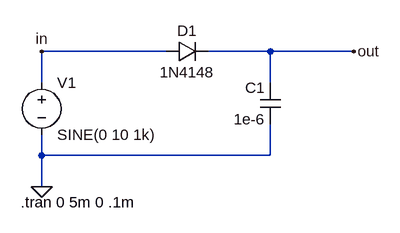
[diagram p0: schematic Sim_1_4.asc]
Sim_1_4.asc, the LTspice schematic file:
Version 4
SHEET 1 1024 680
WIRE 16 -80 -176 -80
WIRE 176 -80 80 -80
WIRE 304 -80 176 -80
WIRE -176 -32 -176 -80
WIRE 176 -32 176 -80
WIRE -176 80 -176 48
WIRE 176 80 176 32
WIRE 176 80 -176 80
WIRE -176 128 -176 80
FLAG -176 128 0
FLAG -176 -80 in
FLAG 304 -80 out
SYMBOL voltage -176 -48 R0
WINDOW 123 0 0 Left 0
WINDOW 39 0 0 Left 0
SYMATTR InstName V1
SYMATTR Value SINE(0 10 1k)
SYMBOL diode 16 -64 R270
WINDOW 0 32 32 VTop 2
WINDOW 3 0 32 VBottom 2
SYMATTR InstName D1
SYMATTR Value 1N4148
SYMBOL cap 192 32 R180
WINDOW 0 24 56 Left 2
WINDOW 3 24 8 Left 2
SYMATTR InstName C1
SYMATTR Value 1e-6
TEXT -208 152 Left 2 !.tran 0 5m 0 .1m

The netlist it stands for:
* Sim_1_4.asc
V1 in 0 SINE(0 10 1k)
D1 in out 1N4148
C1 0 out 1e-6
.model D D
.lib standard.dio
.tran 0 5m 0 .1m
.backanno
.end

* Results of the author's LTspice run, read from the files saved beside the schematic
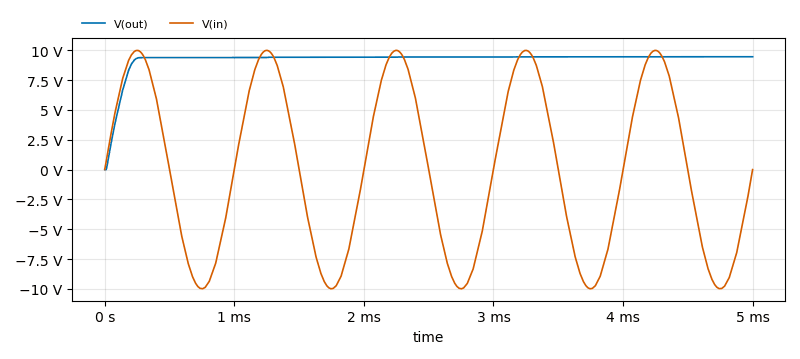
[diagram p1: Transient Analysis of Sim_1_4.asc, plotted from the saved traces]
* Transient Analysis, 1 run:
*   V(out): min 0 V, max 9.465 V, average 9.238 V, rms 9.303 V, last 9.465 V
*   V(in): min -9.998 V, max 10 V, average 4.337 mV, rms 7.184 V, last 0 V